# Altium schematic sheet TP_IHM_POWER.SchDoc
size A4
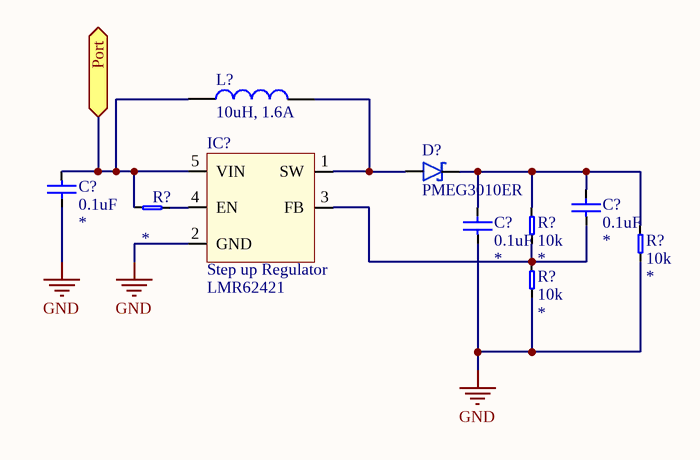
[diagram p0: TP_IHM_POWER.SchDoc]

## Parts
(Parts that share a designator on the sheet are numbered #1, #2 ... from top to bottom, then left to right.)
C?#1  value 0.1uF  [0402_CAP_LD]  (hidden comment: CerCap)
C?#2  value 0.1uF  [0402_CAP_LD]  (hidden comment: CerCap)
C?#3  value 0.1uF  [0402_CAP_LD]  (hidden comment: CerCap)
D?  PMEG3010ER  [SOD123W]
IC?  Step up Regulator  [LMR62421]
L?  10uH, 1.6A  [INDUCTOR_WE-LQS_5020]
R?#1  Resistor  [0402_RES_LD]  (value not drawn)
R?#2  value 10k  [0402_RES_LD]  (hidden comment: Resistor)
R?#3  value 10k  [0402_RES_LD]  (hidden comment: Resistor)
R?#4  value 10k  [0402_RES_LD]  (hidden comment: Resistor)

## Ports
Port

## Nets
GND: C?#2.2 C?#3.1 IC?.2(GND) R?#3.1 R?#4.1
Port: C?#2.1 IC?.5(VIN) L?.1 R?#1.1 ; port Port
NetC?#1_1: C?#1.1 IC?.3(FB) R?#2.1 R?#4.2
NetC?#1_2: C?#1.2 C?#3.2 D?.K R?#2.2 R?#3.2
NetD?_A: D?.A IC?.1(SW) L?.2
NetIC?_4: IC?.4(EN) R?#1.2

## Library data of the parts
C?#1-C?#3 = CerCap: Ceramic Capacitor; Type: *; Voltage/Power: *; Package: *
D? = Schottky_PMEG3010ER: Nexperia 1A low Vf Mega Schottky barrier rectifier; Reference: PMEG3010ER
IC? = LMR62421XMF: LMR62421 simple switcher 24 Vout stepup voltage SOT-23; Reference: LMR62421
L? = INDUCTOR_74404052100: WE-LQS SMD Power Inductor, size 5020, 10uH, 1.6A; DC Resistance: 109mOhm; Inductance Tolerance: +/-20%; Saturation Current: 1.95A; Self Resonant Frequency: 37MHz; ComponentLink1Description: Manufacturer; ComponentLink1URL: http://www.we-online.de; ComponentLink2Description: Datasheet; ComponentLink2URL: https://katalog.we-online.com/pbs/datasheet/74404052100.pdf; Part Number: 74404052100; Published Date: May 2019; Publisher: Wurth Elektronik; Rated Current: 1.6A; Inductance: 10uH; Operating Temperature: -40 to +125degC; Mounting Technology: SMT; Packaging: Tape and Reel; DC Resistance Tolerance: +/-20%; Size: 5020; Reference: 74404052100
R?#1-R?#4 = Resistor: Precision: *; Package: *